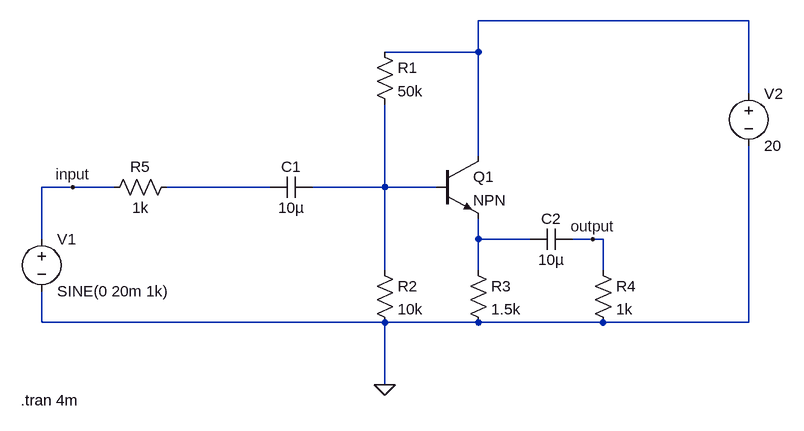
[diagram p0: schematic Common collector of BJT .asc]
Common collector of BJT .asc, the LTspice schematic file:
Version 4
SHEET 1 880 680
WIRE 624 -112 208 -112
WIRE 208 -64 208 -112
WIRE 208 -64 64 -64
WIRE 624 0 624 -112
WIRE 208 96 208 -64
WIRE -416 144 -464 144
WIRE -352 144 -416 144
WIRE -112 144 -272 144
WIRE 64 144 64 16
WIRE 64 144 -48 144
WIRE 144 144 64 144
WIRE -464 224 -464 144
WIRE 208 224 208 192
WIRE 288 224 208 224
WIRE 384 224 352 224
WIRE 400 224 384 224
WIRE 64 272 64 144
WIRE 208 272 208 224
WIRE 400 272 400 224
WIRE -464 352 -464 304
WIRE 64 352 -464 352
WIRE 208 352 64 352
WIRE 400 352 208 352
WIRE 624 352 624 80
WIRE 624 352 400 352
WIRE 64 448 64 352
FLAG 64 448 0
FLAG -416 144 input
FLAG 384 224 output
SYMBOL npn 144 96 R0
SYMATTR InstName Q1
SYMBOL res 192 256 R0
SYMATTR InstName R3
SYMATTR Value 1.5k
SYMBOL res 384 256 R0
SYMATTR InstName R4
SYMATTR Value 1k
SYMBOL res 48 256 R0
SYMATTR InstName R2
SYMATTR Value 10k
SYMBOL res 48 -80 R0
SYMATTR InstName R1
SYMATTR Value 50k
SYMBOL res -256 128 R90
WINDOW 0 0 56 VBottom 2
WINDOW 3 32 56 VTop 2
SYMATTR InstName R5
SYMATTR Value 1k
SYMBOL cap -48 128 R90
WINDOW 0 0 32 VBottom 2
WINDOW 3 32 32 VTop 2
SYMATTR InstName C1
SYMATTR Value 10µ
SYMBOL cap 352 208 R90
WINDOW 0 0 32 VBottom 2
WINDOW 3 32 32 VTop 2
SYMATTR InstName C2
SYMATTR Value 10µ
SYMBOL voltage 624 -16 R0
WINDOW 123 0 0 Left 0
WINDOW 39 0 0 Left 0
SYMATTR InstName V2
SYMATTR Value 20
SYMBOL voltage -464 208 R0
WINDOW 123 0 0 Left 0
WINDOW 39 0 0 Left 0
SYMATTR InstName V1
SYMATTR Value SINE(0 20m 1k)
TEXT -496 472 Left 2 !.tran 4m

The netlist it stands for:
* Common collector of BJT .asc
Q1 N001 N003 N004 0 NPN
R3 N004 0 1.5k
R4 output 0 1k
R2 N003 0 10k
R1 N001 N003 50k
R5 N002 input 1k
C1 N003 N002 10µ
C2 output N004 10µ
V2 N001 0 20
V1 input 0 SINE(0 20m 1k)
.model NPN NPN
.model PNP PNP
.lib standard.bjt
.tran 4m
.backanno
.end